# Altium project PCB_Project2.PrjPCB
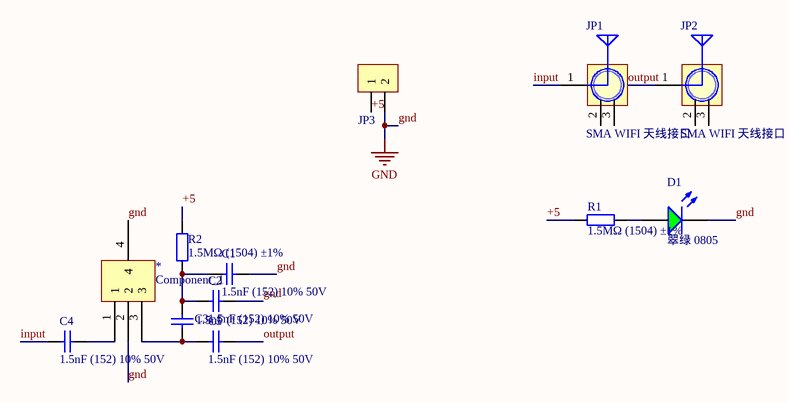
[diagram p0: 射频功放HMC580.SchDoc]
1 sheet, 12 parts. Net scope: global (net labels, ports and power ports of the same name join across sheets).
Board file: 射频功放HMC580.PcbDoc

## Sheet 射频功放HMC580.SchDoc
size A4

### Parts
*  Component_1  [SOT89_N]
C1  1.5nF (152) 10% 50V  [0805_C]
C2  1.5nF (152) 10% 50V  [0805_C]
C3  1.5nF (152) 10% 50V  [0805_C]
C4  1.5nF (152) 10% 50V  [0805_C]
C5  1.5nF (152) 10% 50V  [0805_C]
D1  翠绿 0805  [0805_LED_S1]
JP1  SMA WIFI 天线接口  [SMA-KE]
JP2  SMA WIFI 天线接口  [SMA-KE]
JP3  HDR-1X2  [XH2.54-LI-2P]  (value not drawn)
R1  1.5MΩ (1504) ±1%  [0805_R]
R2  1.5MΩ (1504) ±1%  [0805_R]

### Nets
gnd: *.2 *.4 C1.1 C2.1 D1.K JP3.2
+5: JP3.1 R1.1 R2.2
input: C4.2 JP1.1(ANT)
output: C5.1 JP2.1(ANT)
Net*_1: *.1 C4.1
Net*_3: *.3 C3.1 C5.2
NetC1_2: C1.2 C2.2 C3.2 R2.1
NetD1_A: D1.A R1.2

Not connected (* = marked no-connect by the designer): JP1 2(GND) 3(GND); JP2 2(GND) 3(GND)

### Library data of the parts
C1-C5 = 0805 1.5nF (152) 10% 50V: 贴片电容; ComponentLink1Description: 供应商链接; ComponentLink1URL: http://www.szlcsc.com/product/details_2069.html; Package: 0805; Supplier: LC; SuppliersPartNumber: C1717
D1 = 0805 翠绿: 发光二极管; ComponentLink1Description: 供应商链接; ComponentLink1URL: http://www.szlcsc.com/product/details_2670.html; Package: 0805; Supplier: LC; SuppliersPartNumber: C2297
JP1 JP2 = SMA: SMA-2.4G射频天线接口; BOM名称: SMA-2.4G射频天线接口
JP3 = Header 2: 2P接插件; BOM名称: 2P接插件
R1 R2 = 0805 1.5MΩ (1504) 1%: 贴片电阻; ComponentLink1Description: 供应商链接; ComponentLink1URL: http://www.szlcsc.com/product/details_26853.html; Package: 0805; Supplier: LC; SuppliersPartNumber: C26110